# Altium schematic sheet 07_EEPR_DISCHAR.SchDoc
size A4; Organization: OLTEST; Revision: 01; SheetNumber: 07; SheetTotal: 13; Название листа: Название листа; Разработчик: Бондарчук С.; Прибор: R100; АМАК.000000.000 Э3: R100.230.030.000-00; Дата: 16.04.2019; Формат: A4; WorkSpaceName: R100_Boards_v1
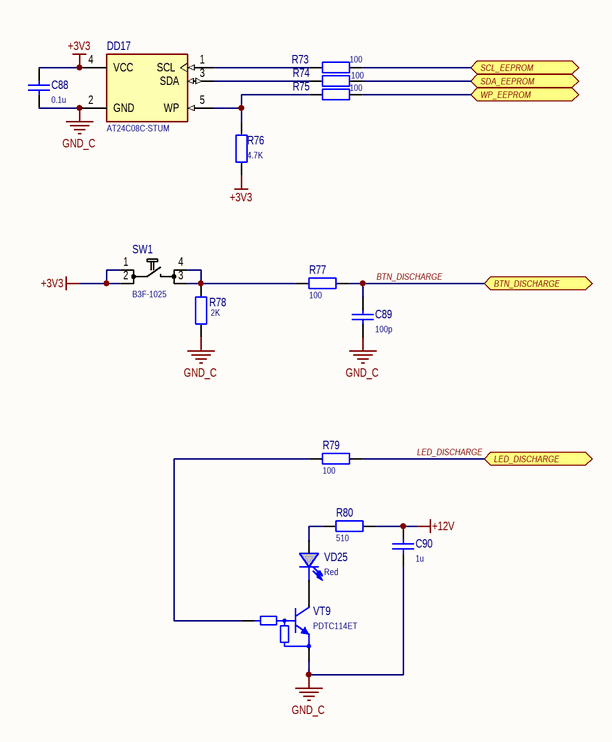
[diagram p0: 07_EEPR_DISCHAR.SchDoc]

## Parts
C88  0.1u  [SMD_C_0603]
C89  100p  [SMD_C_0603]
C90  1u  [SMD_C_0603]
DD17  AT24C08C-STUM  [5TS1]
R73  100  [SMD_R_0603]
R74  100  [SMD_R_0603]
R75  100  [SMD_R_0603]
R76  4.7K  [SMD_R_0805]
R77  100  [SMD_R_0603]
R78  2K  [SMD_R_0805]
R79  100  [SMD_R_0603]
R80  510  [SMD_R_1206]
SW1  B3F-1025  [B3F-1025 (no gnd)]
VD25  value Red  [SMD_LED_LL_Red]  (hidden comment: LL-S172SC-2S)
VT9  PDTC114ET  [SOT23-3]

## Ports
BTN_DISCHARGE, LED_DISCHARGE, SCL_EEPROM, SDA_EEPROM, WP_EEPROM

## Nets
+3V3: C88.2 DD17.4(VCC) R76.1 SW1.1 SW1.2
+12V: C90.2 R80.2
GND_C: C88.1 C89.1 C90.1 DD17.2(GND) R78.1 VT9.2(E)
BTN_DISCHARGE: C89.2 R77.2 ; port BTN_DISCHARGE
LED_DISCHARGE: R79.2 ; port LED_DISCHARGE
SCL_EEPROM: R73.2 ; port SCL_EEPROM
SDA_EEPROM: R74.2 ; port SDA_EEPROM
WP_EEPROM: R75.2 ; port WP_EEPROM
NetDD17_1: DD17.1(SCL) R73.1
NetDD17_3: DD17.3(SDA) R74.1
NetDD17_5: DD17.5(WP) R75.1 R76.2
NetR77_1: R77.1 R78.2 SW1.3 SW1.4
NetR79_1: R79.1 VT9.1(B)
NetR80_1: R80.1 VD25.1(ANODE)
NetVD25_2: VD25.2(CATHODE) VT9.3(C)

## Notes on the sheet
- Разработчик:
- Формат:
- Rev.:
- Лист
- Дата:
- Листов
- WorkSpace:
- Дата изм.:

## Library data of the parts
C88 = C0603 0.1u 50V 10%: SMD C 0603 MURATA 50V 10% X7R; PartNumber: GRM188R71H104K; Manufacturer: MURATA; Value: 0.1u
C89 = C0603 100p 100V 5%: SMD C 0603 MURATA 100V 5% NP0; PartNumber: GRM1885C2A101JA01; Manufacturer: MURATA; Value: 100p
C90 = C0603 1uF 25V 10%: SMD C 0603 MURATA 25V 10% X7R; PartNumber: GRM188R71E105KA12; Manufacturer: MURATA; Value: 1u
DD17 = AT24C08C-STUM: I2C Serial EEPROM, 8-Kbit (1024 x 8); PartNumber: AT24C08C-STUM-T; Manufacturer: ATMEL; ComponentLink1Description: Datasheet; ComponentLink1URL: \\NAS1\DataSheet\9589\AT24C08C.pdf
R73-R75 R77 R79 = R0603 100 1%: SMD R 0603 VISHAY 0.1W 75V 1% 100ppm; PartNumber: CRCW0603100RFK; Manufacturer: VISHAY; Value: 100
R76 = R0805 4.7K 1%: SMD R 0805 VISHAY 0.125W 150V 1% 100ppm; PartNumber: CRCW08054K70FK; Manufacturer: VISHAY; Value: 4.7K
R78 = R0805 2K 1%: SMD R 0805 VISHAY 0.125W 150V 1% 100ppm; PartNumber: CRCW08052K00FK; Manufacturer: VISHAY; Value: 2K
R80 = R1206 510 1%: SMD R 1206 VISHAY 0.25W 200V 1% 100ppm; PartNumber: CRCW1206510RFK; Manufacturer: VISHAY; Value: 510
SW1 = B3F-1025: 1-50mA; 5-24V; 6x6mm h=5mm; Red; Manufacturer: Omron; PartNumber: B3F-1025
VD25 = LL-S172SC-2S: LED Red SMD; Manufacturer: Lucky Light; PartNumber: LL-S172SC-2S
VT9 = PDTC114ET: Digital Transistor (BRT), R1=10 kOhm, R2=10 kOhm, NPN Transistor; Manufacturer: On Semiconductor; PartNumber: PDTC114ET